# Altium schematic sheet MCU.SchDoc
size A4
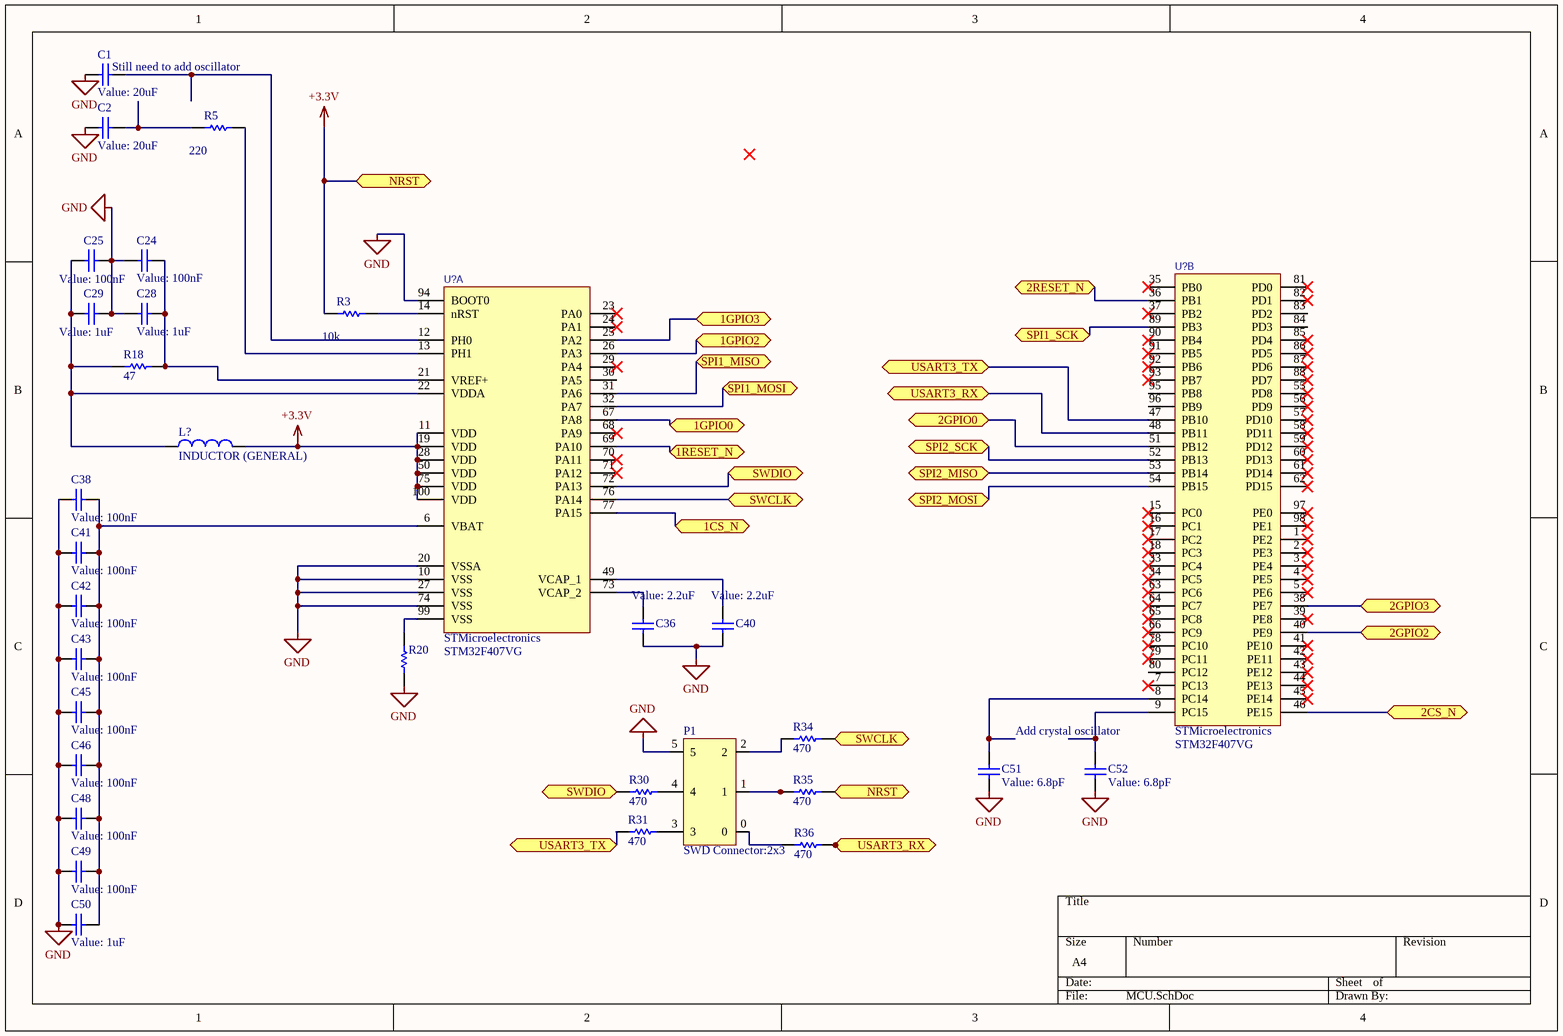
[diagram p0: MCU.SchDoc]

## Parts
(Parts that share a designator on the sheet are numbered #1, #2 ... from top to bottom, then left to right.)
C1  value 20uF  [C0805]  (hidden comment: CAPACITOR (GENERAL))
C2  value 20uF  [C0805]  (hidden comment: CAPACITOR (GENERAL))
C24  value 100nF  [C0805]  (hidden comment: CAPACITOR (GENERAL))
C25  value 100nF  [C0805]  (hidden comment: CAPACITOR (GENERAL))
C28  value 1uF  [C0805]  (hidden comment: CAPACITOR (GENERAL))
C29  value 1uF  [C0805]  (hidden comment: CAPACITOR (GENERAL))
C36  value 2.2uF  [C0805]  (hidden comment: CAPACITOR (GENERAL))
C38  value 100nF  [C0805]  (hidden comment: CAPACITOR (GENERAL))
C40  value 2.2uF  [C0805]  (hidden comment: CAPACITOR (GENERAL))
C41  value 100nF  [C0805]  (hidden comment: CAPACITOR (GENERAL))
C42  value 100nF  [C0805]  (hidden comment: CAPACITOR (GENERAL))
C43  value 100nF  [C0805]  (hidden comment: CAPACITOR (GENERAL))
C45  value 100nF  [C0805]  (hidden comment: CAPACITOR (GENERAL))
C46  value 100nF  [C0805]  (hidden comment: CAPACITOR (GENERAL))
C48  value 100nF  [C0805]  (hidden comment: CAPACITOR (GENERAL))
C49  value 100nF  [C0805]  (hidden comment: CAPACITOR (GENERAL))
C50  value 1uF  [C0805]  (hidden comment: CAPACITOR (GENERAL))
C51  value 6.8pF  [C0805]  (hidden comment: CAPACITOR (GENERAL))
C52  value 6.8pF  [C0805]  (hidden comment: CAPACITOR (GENERAL))
L?  INDUCTOR (GENERAL)  [0402-A]
P1  SWD Connector:2x3
R3  value 10k  (hidden comment: RESISTOR (GENERAL))
R5  value 220  (hidden comment: RESISTOR (GENERAL))
R18  value 47  (hidden comment: RESISTOR (GENERAL))
R20  General Resistor  (value not drawn)
R30  value 470  (hidden comment: RESISTOR (GENERAL))
R31  value 470  (hidden comment: RESISTOR (GENERAL))
R34  value 470  (hidden comment: RESISTOR (GENERAL))
R35  value 470  (hidden comment: RESISTOR (GENERAL))
R36  value 470  (hidden comment: RESISTOR (GENERAL))
U?#1  Manufacturer: STMicroelectronics  (hidden comment: STM32F407VG)  (part B of 2)
U?#2  Manufacturer: STMicroelectronics  (hidden comment: STM32F407VG)  (part A of 2)

## Ports
1CS_N, 1GPIO0, 1GPIO2, 1GPIO3, 1RESET_N, 2CS_N, 2GPIO0, 2GPIO2, 2GPIO3, 2RESET_N, NRST, SPI1_MISO, SPI1_MOSI, SPI1_SCK, SPI2_MISO, SPI2_MOSI, SPI2_SCK, SWCLK, SWDIO, USART3_RX, USART3_TX

## Nets
+3.3V: L?.2 R3.1 R35.1 U?#2.11(VDD) U?#2.19(VDD) U?#2.28(VDD) U?#2.50(VDD) U?#2.75(VDD) U?#2.100(VDD) ; port NRST
GND: C1.2 C2.2 C24.2 C25.1 C28.2 C29.1 C36.1 C38.1 C40.1 C41.1 C42.1 C43.1 C45.1 C46.1 C48.1 C49.1 C50.1 C51.1 C52.1 P1.5 R20.1 U?#2.10(VSS) U?#2.20(VSSA) U?#2.27(VSS) U?#2.74(VSS) U?#2.94(BOOT0)
1CS_N: U?#2.77(PA15) ; port 1CS_N
1GPIO0: U?#2.67(PA8) ; port 1GPIO0
1GPIO2: U?#2.26(PA3) ; port 1GPIO2
1GPIO3: U?#2.25(PA2) ; port 1GPIO3
1RESET_N: U?#2.69(PA10) ; port 1RESET_N
2CS_N: U?#1.46(PE15) ; port 2CS_N
2GPIO0: U?#1.51(PB12) ; port 2GPIO0
2GPIO2: U?#1.40(PE9) ; port 2GPIO2
2GPIO3: U?#1.38(PE7) ; port 2GPIO3
2RESET_N: U?#1.36(PB1) ; port 2RESET_N
SPI1_MISO: U?#2.31(PA6) ; port SPI1_MISO
SPI1_MOSI: U?#2.32(PA7) ; port SPI1_MOSI
SPI1_SCK: U?#1.89(PB3) ; port SPI1_SCK
SPI2_MISO: U?#1.53(PB14) ; port SPI2_MISO
SPI2_MOSI: U?#1.54(PB15) ; port SPI2_MOSI
SPI2_SCK: U?#1.52(PB13) ; port SPI2_SCK
SWCLK: R34.1 U?#2.76(PA14) ; port SWCLK
SWDIO: R30.2 U?#2.72(PA13) ; port SWDIO
USART3_RX: R36.1 U?#1.48(PB11) ; port USART3_RX
USART3_TX: R31.2 U?#1.47(PB10) ; port USART3_TX
NetC1_1: C1.1 U?#2.12(PH0)
NetC2_1: C2.1 R5.1
NetC24_1: C24.1 C28.1 R18.1 U?#2.21(VREF+)
NetC25_2: C25.2 C29.2 L?.1 R18.2 U?#2.22(VDDA)
NetC36_2: C36.2 U?#2.73(VCAP_2)
NetC38_2: C38.2 C41.2 C42.2 C43.2 C45.2 C46.2 C48.2 C49.2 C50.2 U?#2.6(VBAT)
NetC40_2: C40.2 U?#2.49(VCAP_1)
NetC51_2: C51.2 U?#1.8(PC14)
NetC52_2: C52.2 U?#1.9(PC15)
NetP1_0: P1.0 R36.2
NetP1_1: P1.1 R35.2
NetP1_3: P1.3 R31.1
NetR3_2: R3.2 U?#2.14(nRST)
NetR5_2: R5.2 U?#2.13(PH1)
NetR20_2: R20.2 U?#2.99(VSS)

Not connected (* = marked no-connect by the designer): P1 2 4; R30 1; R34 2; U?#1 1(PE2)* 2(PE3)* 3(PE4)* 4(PE5)* 5(PE6)* 7(PC13)* 15(PC0)* 16(PC1)* 17(PC2)* 18(PC3)* 33(PC4)* 34(PC5)* 35(PB0)* 37(PB2)* 39(PE8)* 41(PE10)* 42(PE11)* 43(PE12)* 44(PE13)* 45(PE14)* 55(PD8)* 56(PD9)* 57(PD10)* 58(PD11)* 59(PD12)* 60(PD13)* 61(PD14)* 62(PD15)* 63(PC6)* 64(PC7)* 65(PC8)* 66(PC9)* 78(PC10)* 79(PC11)* 80(PC12) 81(PD0)* 82(PD1)* 83(PD2) 84(PD3) 85(PD4)* 86(PD5)* 87(PD6)* 88(PD7)* 90(PB4)* 91(PB5)* 92(PB6)* 93(PB7)* 95(PB8) 96(PB9) 97(PE0)* 98(PE1)*; U?#2 23(PA0)* 24(PA1)* 29(PA4)* 30(PA5) 68(PA9)* 70(PA11)* 71(PA12)*

## Notes on the sheet
- (near C1) Still need to add oscillator
- Add crystal oscillator

## Library data of the parts
C1 C2 C24 C25 C28 C29 C36 C38 C40-C43 C45 C46 C48-C52 = CAPACITOR (GENERAL): Capacitor; Supplier 1: Digi-Key; Supplier Part Number 1: *
L? = INDUCTOR (GENERAL): Inductor; Supplier 1: Digi-Key; Supplier Part Number 1: *; Value: *
P1 = Connector:2x3
R3 R5 R18 R30 R31 R34-R36 = RESISTOR (GENERAL): Resistor; Supplier 1: Digi-Key; Supplier Part Number 1: TBD
R20 = RESISTOR (GENERAL): Resistor; Value: 0; Supplier 1: Digi-Key; Supplier Part Number 1: TBD
U?#1 U?#2 = STM32F407: Distributor: Digi-Key; Distributor Part Number: *; Manufacturer Part Number: STM32F407VG